# EAGLE design U2FHIDDevice_0 (EAGLE 7.7.0)

## Sheet 1 of 3
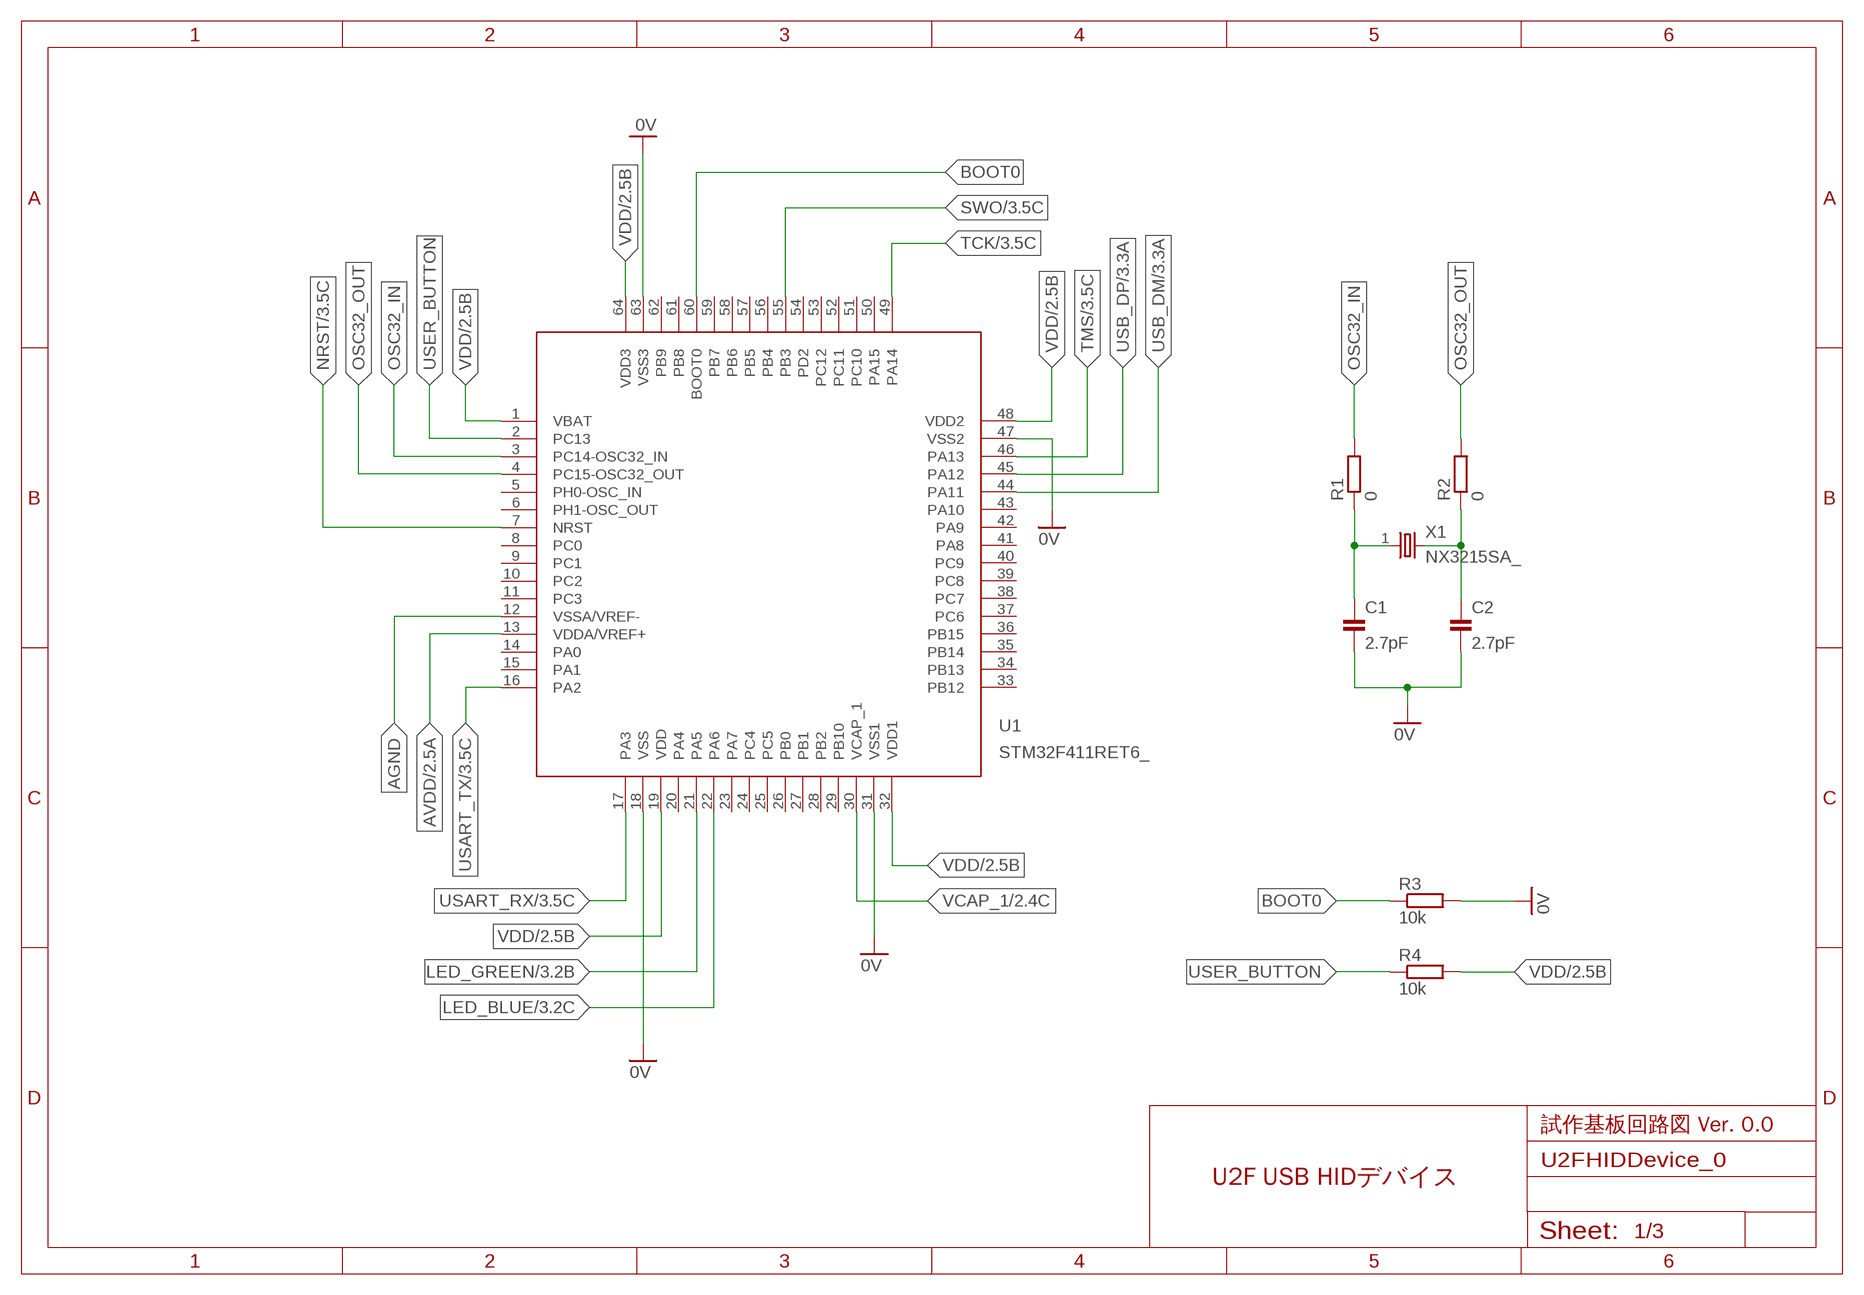
[diagram p0: schematic, sheet 1]

### Parts
C1  2.7pF  CAP_0603  [C0603K]
C2  2.7pF  CAP_0603  [C0603K]
R1  0  RESISTOR_0603  [R0603]
R2  0  RESISTOR_0603  [R0603]
R3  10k  RESISTOR_0603  [R0603]
R4  10k  RESISTOR_0603  [R0603]
U1  STM32F411RET6_  [LQFP64-10X10_DEV]
X1  NX3215SA_  [NX3215_DEV]

### Nets
0V: C1.2 C2.2 R3.2 U1.18(VSS) U1.31(VSS1) U1.47(VSS2) U1.63(VSS3) ; also sheet 2,3
AGND: U1.12(VSSA/VREF-) ; also sheet 2
AVDD: U1.13(VDDA/VREF+) ; also sheet 2
BOOT0: R3.1 U1.60(BOOT0)
LED_BLUE: U1.22(PA6) ; also sheet 3
LED_GREEN: U1.21(PA5) ; also sheet 3
N$2: C1.1 R1.1 X1.1
N$3: C2.1 R2.1 X1.2
NRST: U1.7(NRST) ; also sheet 3
OSC32_IN: R1.2 U1.3(PC14-OSC32_IN)
OSC32_OUT: R2.2 U1.4(PC15-OSC32_OUT)
SWO: U1.55(PB3) ; also sheet 3
TCK: U1.49(PA14) ; also sheet 3
TMS: U1.46(PA13) ; also sheet 3
USART_RX: U1.17(PA3) ; also sheet 3
USART_TX: U1.16(PA2) ; also sheet 3
USB_DM: U1.44(PA11) ; also sheet 3
USB_DP: U1.45(PA12) ; also sheet 3
USER_BUTTON: R4.1 U1.2(PC13)
VCAP_1: U1.30(VCAP_1) ; also sheet 2
VDD: R4.2 U1.1(VBAT) U1.19(VDD) U1.32(VDD1) U1.48(VDD2) U1.64(VDD3) ; also sheet 2
Unconnected: U1.5(PH0-OSC_IN) U1.6(PH1-OSC_OUT) U1.8(PC0) U1.9(PC1) U1.10(PC2) U1.11(PC3) U1.14(PA0) U1.15(PA1) U1.20(PA4) U1.23(PA7) U1.24(PC4) U1.25(PC5) U1.26(PB0) U1.27(PB1) U1.28(PB2) U1.29(PB10) U1.33(PB12) U1.34(PB13) U1.35(PB14) U1.36(PB15) U1.37(PC6) U1.38(PC7) U1.39(PC8) U1.40(PC9) U1.41(PA8) U1.42(PA9) U1.43(PA10) U1.50(PA15) U1.51(PC10) U1.52(PC11) U1.53(PC12) U1.54(PD2) U1.56(PB4) U1.57(PB5) U1.58(PB6) U1.59(PB7) U1.61(PB8) U1.62(PB9)

### Notes on the sheet
- 試作基板回路図 Ver. 0.0
- U2F USB HIDデバイス

## Sheet 2 of 3
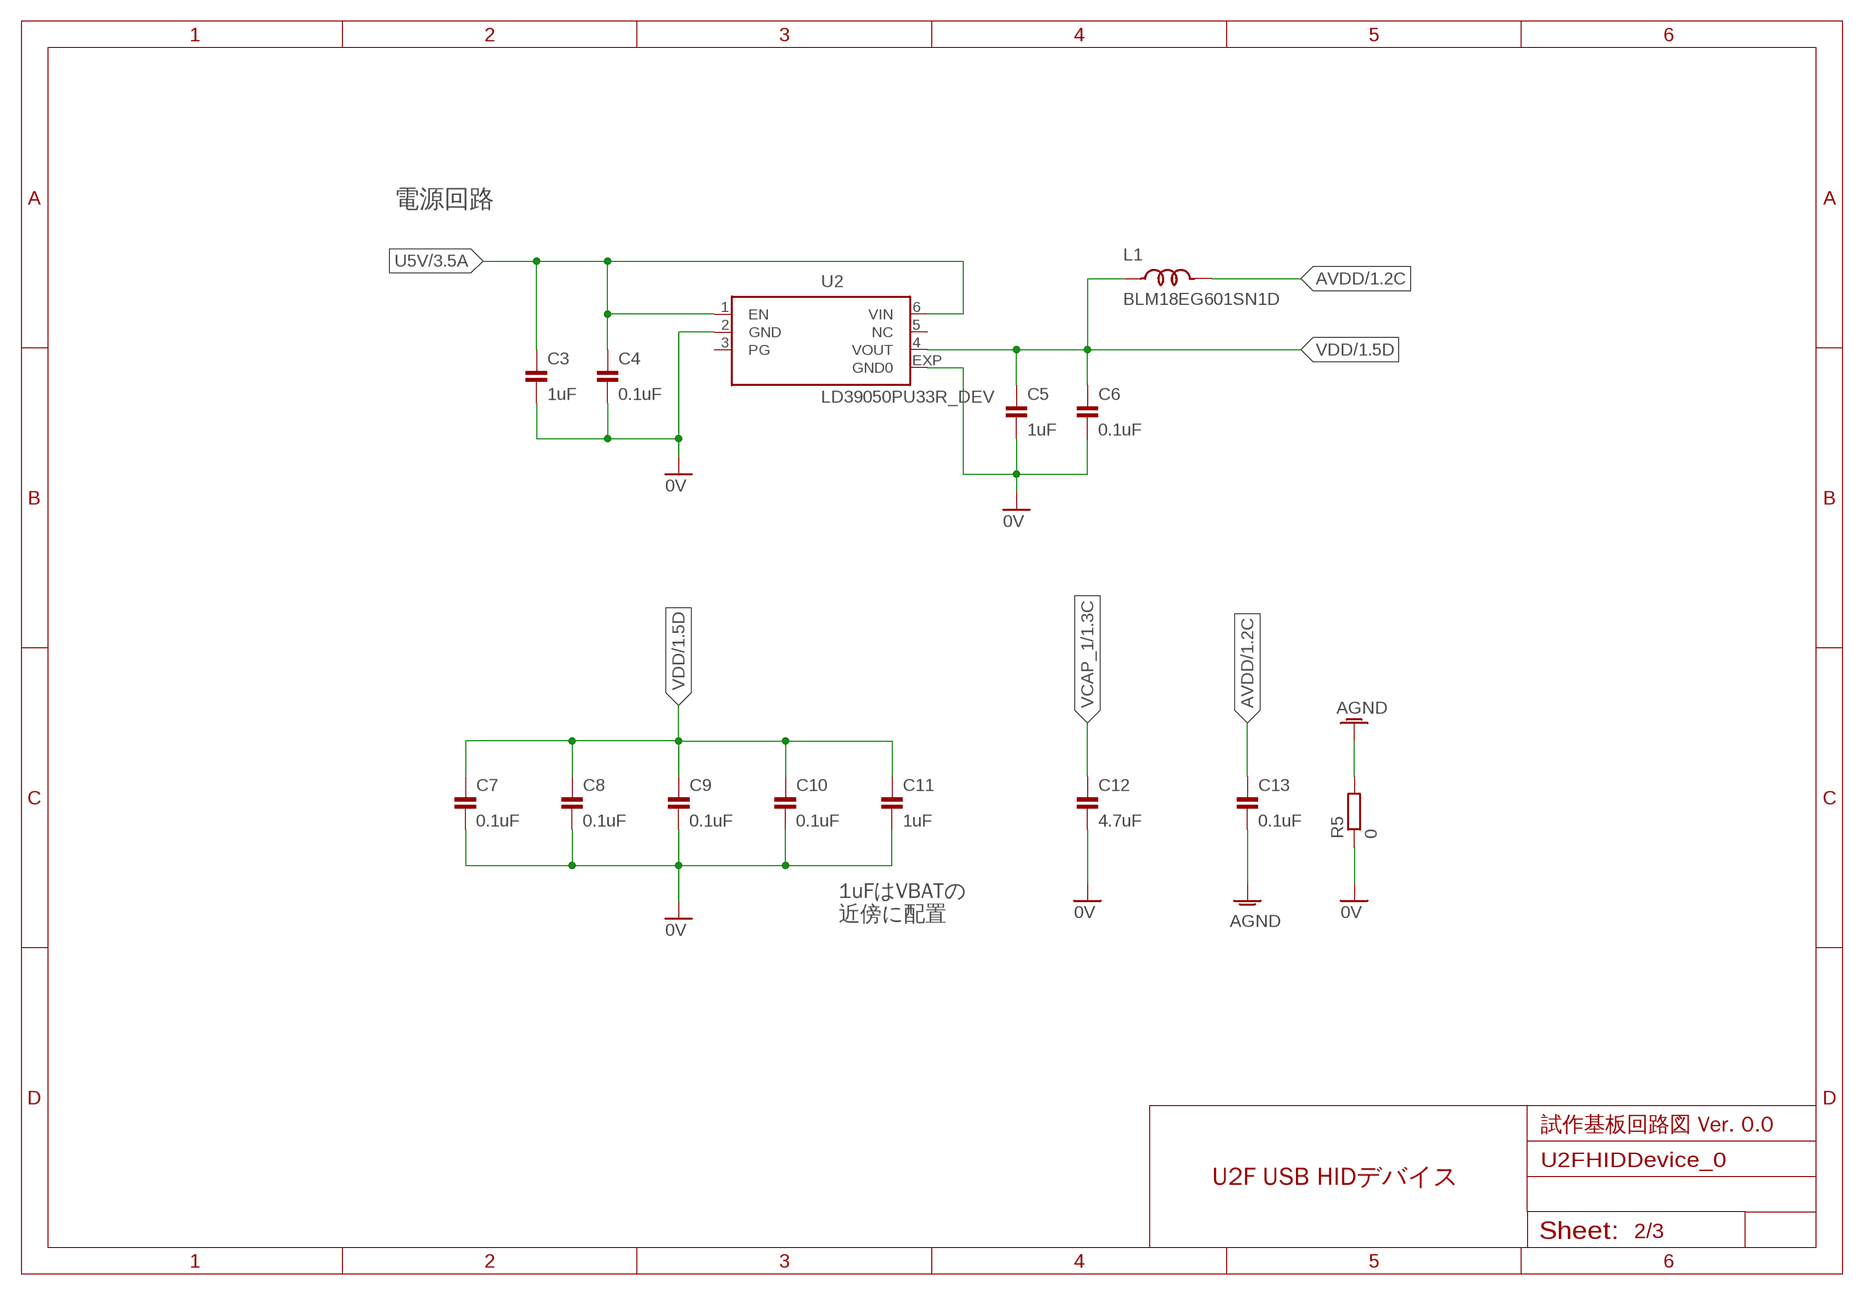
[diagram p1: schematic, sheet 2]

### Parts
C3  1uF  CAP_0603  [C0603K]
C4  0.1uF  CAP_0603  [C0603K]
C5  1uF  CAP_0603  [C0603K]
C6  0.1uF  CAP_0603  [C0603K]
C7  0.1uF  CAP_0603  [C0603K]
C8  0.1uF  CAP_0603  [C0603K]
C9  0.1uF  CAP_0603  [C0603K]
C10  0.1uF  CAP_0603  [C0603K]
C11  1uF  CAP_0603  [C0603K]
C12  4.7uF  CAP_1206  [C1206]
C13  0.1uF  CAP_0603  [C0603K]
L1  BLM18EG601SN1D  [R0603]
R5  0  RESISTOR_0603  [R0603]
U2  LD39050PU33R_DEV  [DFN6-3X3_DEV]

### Nets
0V: C3.2 C4.2 C5.2 C6.2 C7.2 C8.2 C9.2 C10.2 C11.2 C12.2 R5.1 U2.2(GND) U2.EXP(GND0) ; also sheet 1,3
AGND: C13.2 R5.2 ; also sheet 1
AVDD: C13.1 L1.2 ; also sheet 1
U5V: C3.1 C4.1 U2.1(EN) U2.6(VIN) ; also sheet 3
VCAP_1: C12.1 ; also sheet 1
VDD: C5.1 C6.1 C7.1 C8.1 C9.1 C10.1 C11.1 L1.1 U2.4(VOUT) ; also sheet 1
Unconnected: U2.3(PG) U2.5(NC)

### Notes on the sheet
- 電源回路
- 1uFはVBATの
  近傍に配置
- 試作基板回路図 Ver. 0.0
- U2F USB HIDデバイス

## Sheet 3 of 3
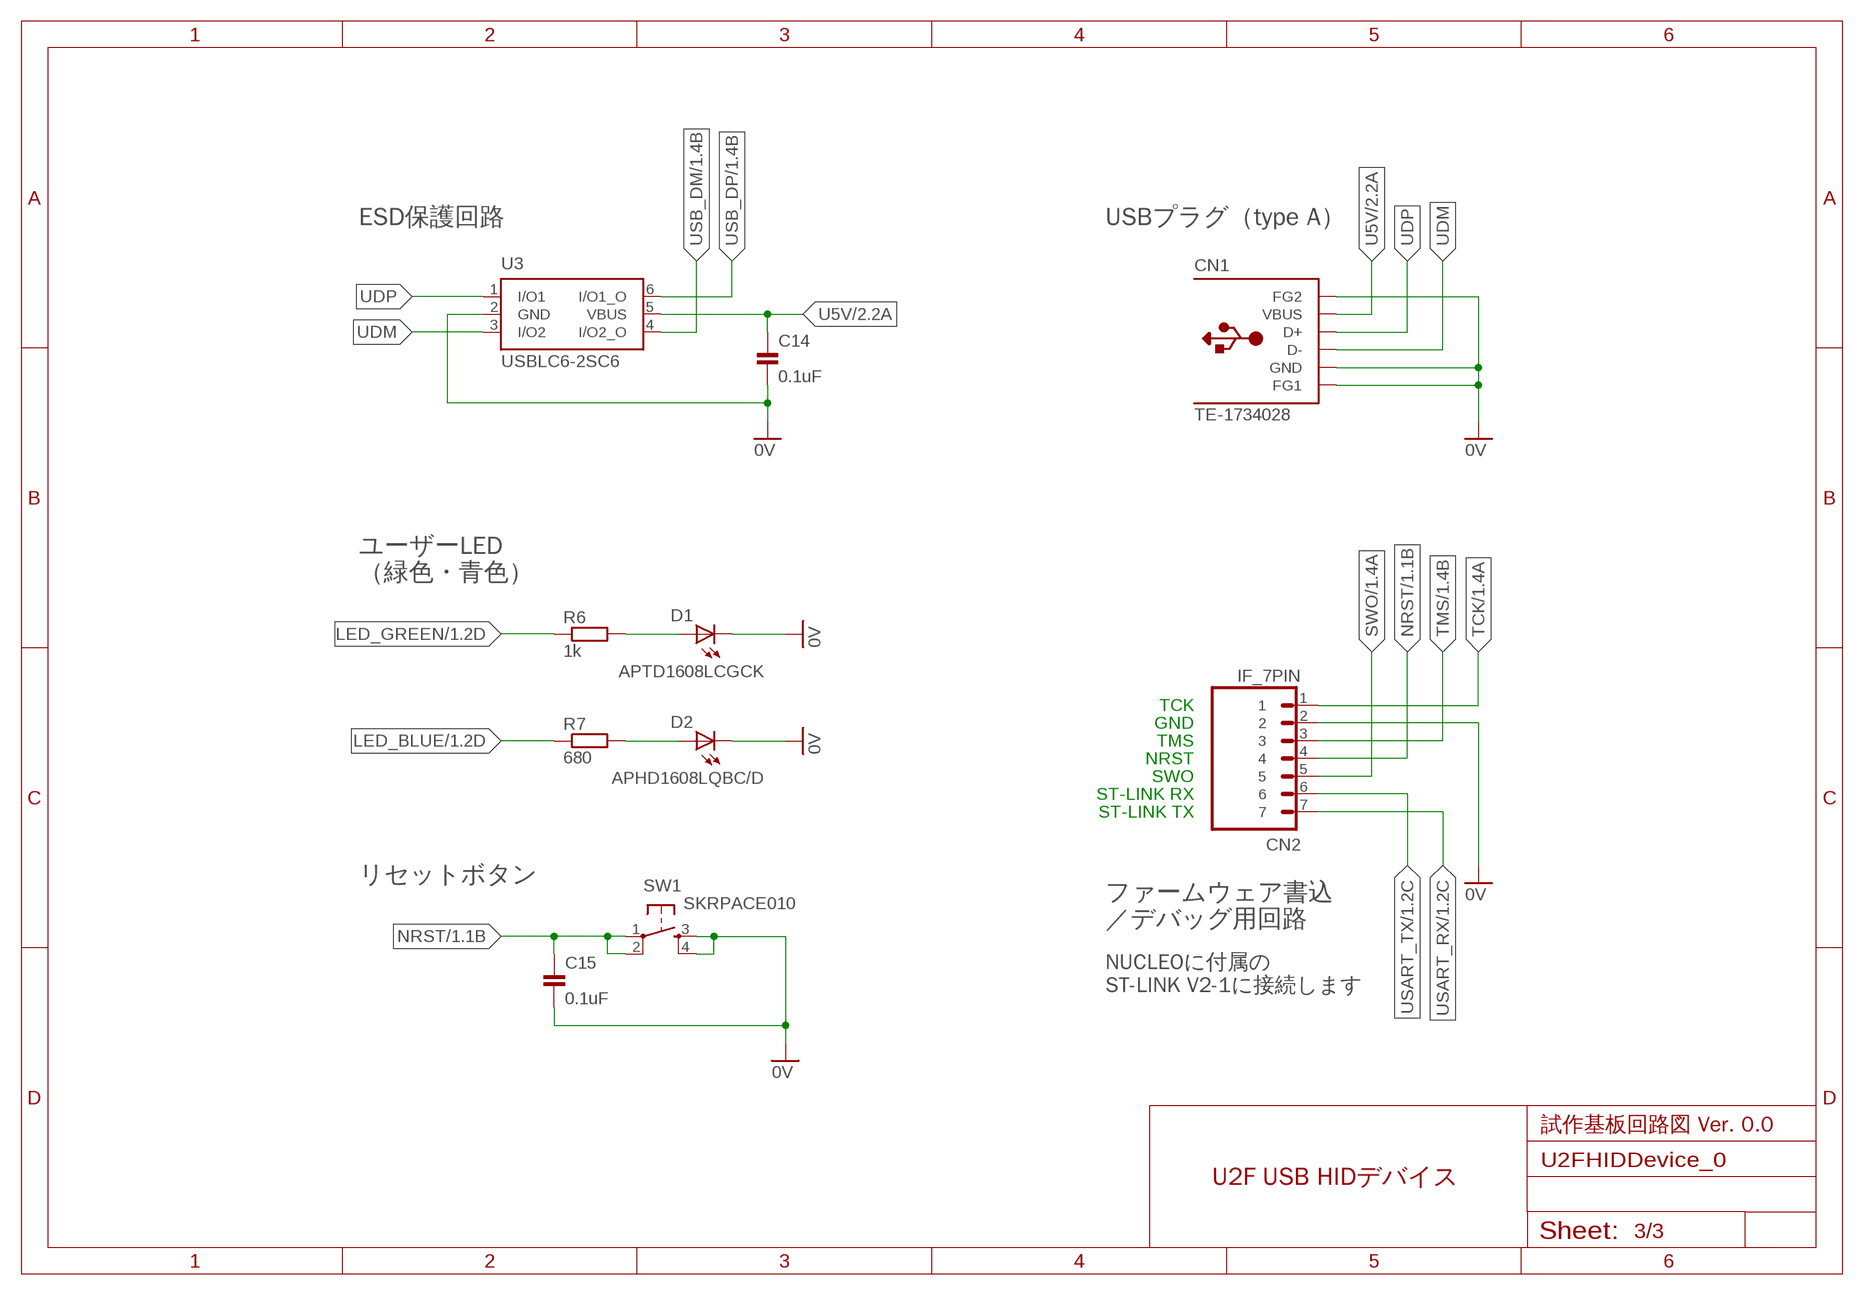
[diagram p2: schematic, sheet 3]

### Parts
C14  0.1uF  CAP_0603  [C0603K]
C15  0.1uF  CAP_0603  [C0603K]
CN1  TE-1734028  [TE-1734028]
CN2  IF_7PIN  [HEADER_7PIN]
D1  APTD1608LCGCK  [CHIPLED_0603]
D2  APHD1608LQBC/D  [CHIPLED_0603]
R6  1k  RESISTOR_0603  [R0603]
R7  680  RESISTOR_0603  [R0603]
SW1  SKRPACE010  [SKRPACE010]
U3  USBLC6-2SC6  [SOT23-6L]

### Nets
0V: C14.2 C15.2 CN1.FG1 CN1.FG2 CN1.P$4(GND) CN2.2 D1.C D2.C SW1.3(S) SW1.4(S1) U3.2(GND) ; also sheet 1,2
LED_BLUE: R7.1 ; also sheet 1
LED_GREEN: R6.1 ; also sheet 1
N$1: D1.A R6.2
N$4: D2.A R7.2
NRST: C15.1 CN2.4 SW1.1(P) SW1.2(P1) ; also sheet 1
SWO: CN2.5 ; also sheet 1
TCK: CN2.1 ; also sheet 1
TMS: CN2.3 ; also sheet 1
U5V: C14.1 CN1.P$1(VBUS) U3.5(VBUS) ; also sheet 2
UDM: CN1.P$2(D-) U3.3(I/O2)
UDP: CN1.P$3(D+) U3.1(I/O1)
USART_RX: CN2.7 ; also sheet 1
USART_TX: CN2.6 ; also sheet 1
USB_DM: U3.4(I/O2_O) ; also sheet 1
USB_DP: U3.6(I/O1_O) ; also sheet 1

### Notes on the sheet
- ESD保護回路 | USBプラグ（type A）
- ユーザーLED
  （緑色・青色）
- TCK
- GND
- TMS
- NRST
- SWO
- ST-LINK RX
- ST-LINK TX
- リセットボタン
- ファームウェア書込
  ／デバッグ用回路
- NUCLEOに付属の
  ST-LINK V2-1に接続します
- 試作基板回路図 Ver. 0.0
- U2F USB HIDデバイス

## Library data of the parts
C1-C15 = Parts:CAP: コンデンサー
CN1 = Connectors:TE-1734028: USB connector plug TE Connectivity
CN2 = Connectors:IF_7PIN: 7-pin インターフェース
D1 = Parts:APTD1608: 発光ダイオード
D2 = Parts:APHD1608: 発光ダイオード
L1 = Parts:BLM18EG: フェライトビーズ インピーダンス: 100 Ohms @ 100 MHz 最大 DC 電流: 2 A 最大 DC 抵抗: 45 mOhms 動作温度範囲: - 55 C to + 125 C
R1-R7 = Parts:RESISTOR: 抵抗器
SW1 = Parts:SKRPACE010: 表面実装用タクトスイッチ ４．２×３．２ｍｍ小型重作動力タイプ ・作動力：２．５５Ｎ ・操作方向：垂直 ・移動量：０．２ｍｍ ・動作寿命：５０，０００ｃｙｃｌｅｓ （５ｍＡ ５ＶＤＣ） ・初期接触抵抗：最大５００ｍΩ
U1 = Parts:STM32F411RE: ARM マイクロコントローラ 最高クロック周波数: 100 MHz プログラム メモリ サイズ: 512 kB データ RAM サイズ: 128 kB ADC分解能: 12 bit I/O 数: 50 I/O 動作供給電圧: 3.3 V 最低動作温度: - 40 C 最高動作温度: + 85 C
U2 = Parts:LD39050PU33R: LDO電圧レギュレータ 出力電圧: 3.3 V 出力電流: 500 mA 入力電圧最大値: 5.5 V 最小入力電圧: + 1.5 V 出力タイプ: Fixed 最低動作温度: - 40 C 最高動作温度: + 125 C
U3 = Parts:USBLC6-2: Very low capacitance ESD protection
X1 = Parts:NX3215SA: 水晶振動子 周波数 32.768kHz 周波数公差 ±20ppm 負荷容量 6pF ESR（等価直列抵抗） 70 kOhms 動作温度 -40°C～85°C

## Board
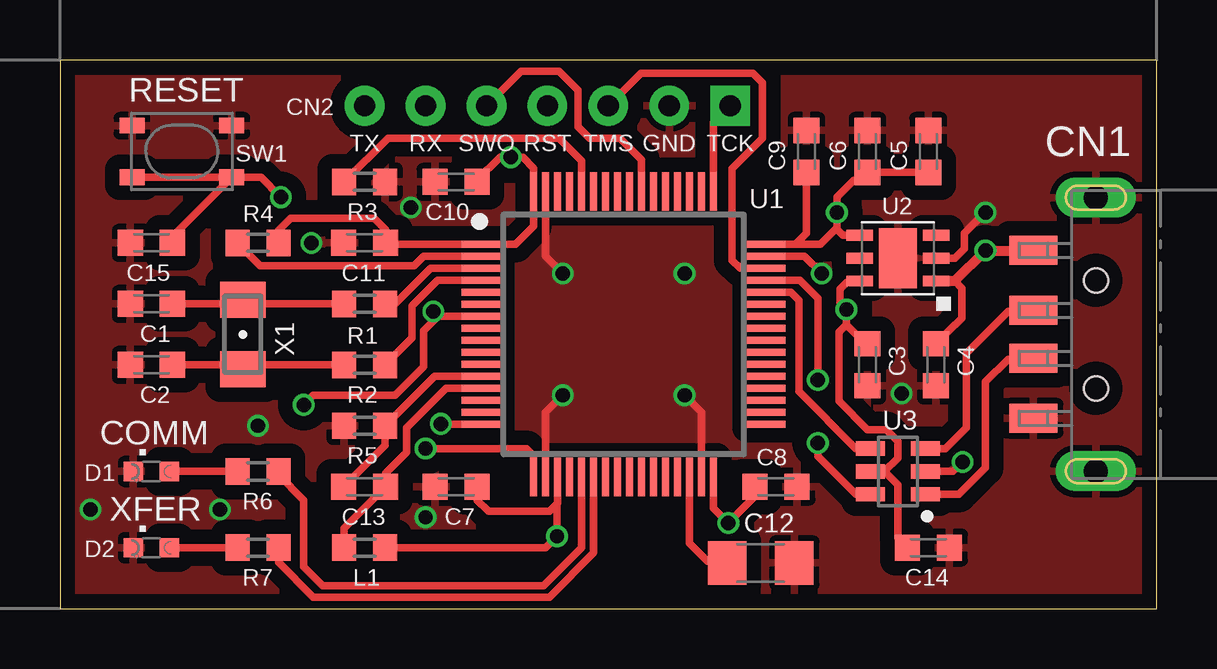
[diagram p3: board, top side]
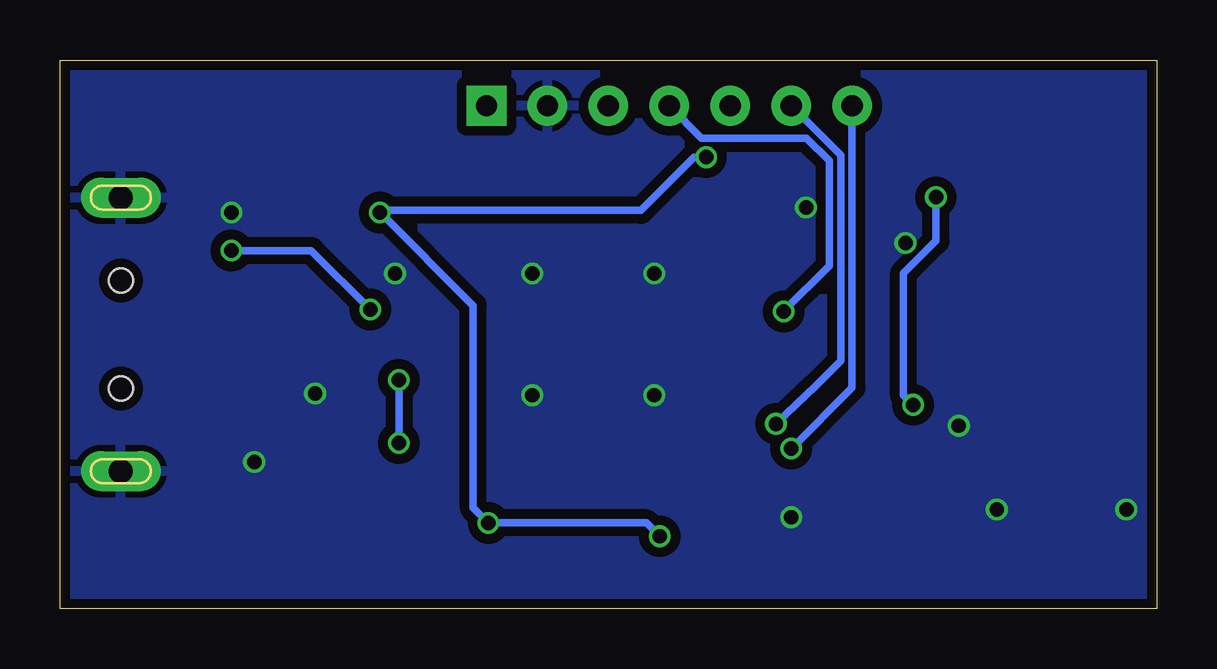
[diagram p4: board, bottom side, seen from below]

Size 45.72 x 22.86 mm. Coordinates in mm from the lower left corner, seen from the top.
Outline: 0,0 45.72,0 45.72,22.86 0,22.86 0,0
Copper layers (1*16): Top 0.035mm / dielectric 1.5mm / Bottom 0.035mm
Design rules "SeeedStudio_2layer_DRU_no_angle_20140221": minimum track width 6mil, minimum drill 12mil, track to track 6mil, track to pad 6mil, pad to pad 6mil, via to via 6mil, smd to smd 0mil, copper to edge 10mil, drill to drill 10mil, minimum pad ring 10mil, minimum via ring 6mil, stop-mask expansion 2mil, vias tented up to drill 100mil, thermal gap 10mil

### Footprints (pad centres in the part's own frame; a part is rotated, then mirrored left to right if it is on the bottom)
C0603K = smd 1.05 x 1.08: 1 -0.875,0; 2 0.875,0
C1206 = smd 1.6 x 1.8: 1 -1.4,0; 2 1.4,0
TE-1734028 = drill 1 pad 1.676 long: FG1 -5.7,0; FG2 5.7,0 | smd 1.2 x 2: P$1 3.5,2.6; P$2 1,2.6; P$3 -1,2.6; P$4 -3.5,2.6 | hole 1: -2.25,0; 2.25,0
HEADER_7PIN = drill 0.889 pad 1.651 square: 1 0,0 | drill 0.889 pad 1.651: 2 2.54,0; 3 5.08,0; 4 7.62,0; 5 10.16,0; 6 12.7,0; 7 15.24,0
CHIPLED_0603 = smd 0.8 x 0.8: A -0.75,0; C 0.75,0
R0603 = smd 1 x 1.1: 1 -0.85,0; 2 0.85,0
SKRPACE010 = smd 1.05 x 0.65: 1 -2.075,1.075; 2 2.075,1.075; 3 -2.075,-1.075; 4 2.075,-1.075
LQFP64-10X10_DEV = smd 1.6 x 0.3: 1 -5.95,3.75; 2 -5.95,3.25; 3 -5.95,2.75; 4 -5.95,2.25; 5 -5.95,1.75; 6 -5.95,1.25; 7 -5.95,0.75; 8 -5.95,0.25; 9 -5.95,-0.25; 10 -5.95,-0.75; 11 -5.95,-1.25; 12 -5.95,-1.75; 13 -5.95,-2.25; 14 -5.95,-2.75; 15 -5.95,-3.25; 16 -5.95,-3.75; 33 5.95,-3.75; 34 5.95,-3.25; 35 5.95,-2.75; 36 5.95,-2.25; 37 5.95,-1.75; 38 5.95,-1.25; 39 5.95,-0.75; 40 5.95,-0.25; 41 5.95,0.25; 42 5.95,0.75; 43 5.95,1.25; 44 5.95,1.75; 45 5.95,2.25; 46 5.95,2.75; 47 5.95,3.25; 48 5.95,3.75 | smd 0.3 x 1.6: 17 -3.75,-5.95; 18 -3.25,-5.95; 19 -2.75,-5.95; 20 -2.25,-5.95; 21 -1.75,-5.95; 22 -1.25,-5.95; 23 -0.75,-5.95; 24 -0.25,-5.95; 25 0.25,-5.95; 26 0.75,-5.95; 27 1.25,-5.95; 28 1.75,-5.95; 29 2.25,-5.95; 30 2.75,-5.95; 31 3.25,-5.95; 32 3.75,-5.95; 49 3.75,5.95; 50 3.25,5.95; 51 2.75,5.95; 52 2.25,5.95; 53 1.75,5.95; 54 1.25,5.95; 55 0.75,5.95; 56 0.25,5.95; 57 -0.25,5.95; 58 -0.75,5.95; 59 -1.25,5.95; 60 -1.75,5.95; 61 -2.25,5.95; 62 -2.75,5.95; 63 -3.25,5.95; 64 -3.75,5.95
DFN6-3X3_DEV = smd 1.1 x 0.45: 1 -1.6,0.95; 2 -1.6,0; 3 -1.6,-0.95; 4 1.6,-0.95; 5 1.6,0; 6 1.6,0.95 | smd 1.6 x 2.5: EXP 0,0
SOT23-6L = smd 0.6 x 1.2: 1 -0.95,-1.15; 2 0,-1.15; 3 0.95,-1.15; 4 0.95,1.15; 5 0,1.15; 6 -0.95,1.15
NX3215_DEV = smd 1.5 x 1.9: 1 -1.45,0; 2 1.45,0

### Placement (x,y rotation side)
C1  3.81,12.7 180 top
C2  3.81,10.16 180 top
C3  33.66,10.16 270 top
C4  36.51,10.16 270 top
C5  36.2,19.05 90 top
C6  33.66,19.05 90 top
C7  16.51,5.08 180 top
C8  29.84,5.08 0 top
C9  31.11,19.05 90 top
C10  16.51,17.78 180 top
C11  12.7,15.24 180 top
C12  29.21,1.91 0 top
C13  12.7,5.08 180 top
C14  36.2,2.54 0 top
C15  3.81,15.24 180 top
CN1  43.18,11.43 90 top
CN2  27.94,20.95 180 top
D1  3.81,5.71 180 top
D2  3.81,2.54 180 top
L1  12.7,2.54 180 top
R1  12.7,12.7 0 top
R2  12.7,10.16 0 top
R3  12.7,17.78 0 top
R4  8.26,15.24 0 top
R5  12.7,7.62 0 top
R6  8.26,5.71 180 top
R7  8.26,2.54 180 top
SW1  5.08,19.05 180 top
U1  23.5,11.43 0 top
U2  34.92,14.61 180 top
U3  34.92,5.71 90 top
X1  7.62,11.43 270 top

### Tracks (layer width: path | path; a pad name or v marks a point on that pad's centre or on a via)
0V  (via drill 0.6)
  Top 0.305: U3.2 37.23,5.71 v37.62,6.11 | U1.18 20.25,8.18 v20.95,8.89 | U1.31 26.75,8.18 v26.04,8.89 | U1.63 20.25,14.68 v20.95,13.97 | U1.47 31.04,14.68 v31.75,13.97 | 38.58,16.35 v38.58,16.51 37.7,15.63 37.7,15 37.3,14.61 U2.2
  other vias: 26.04,13.97 35.08,8.97 8.26,7.62 6.67,4.13 15.24,3.81 14.62,16.71 10.48,15.24 1.27,4.13
  pour Bottom (isolate 0.406, rank 3): -2.54,25.4 48.26,25.4 48.26,-2.54 -2.54,-2.54
  pour Top (isolate 0.61, rank 3): -0.64,23.5 46.35,23.5 46.35,-0.64 -0.64,-0.64
AGND
  Top 0.305: U1.12 15.61,9.68 R5.2 13.55,6.8 C13.2
AVDD
  Top 0.305: U1.13 16.09,9.18 14.45,7.54 14.45,6.51 13.57,5.64 C13.1 11.85,3.35 L1.2
BOOT0
  Top 0.305: U1.60 21.75,18.66 20.8,19.61 13.68,19.61 R3.1
LED_BLUE
  Top 0.305: R7.1 9.11,1.93 10.56,0.48 20.4,0.48 22.25,2.32 U1.22
LED_GREEN
  Top 0.305: R6.1 9.11,5.58 10.16,4.52 10.16,1.75 10.95,0.95 20.16,0.95 21.75,2.54 21.75,5.68 U1.21
N$1
  Top 0.305: D1.A R6.2
N$2
  Top 0.305: C1.1 7.6,12.7 X1.1 7.8,12.7 R1.1
N$3
  Top 0.305: C2.1 7.6,10.16 X1.2 7.8,10.16 R2.1
N$4
  Top 0.305: D2.A R7.2
NRST  (via drill 0.6)
  Top 0.305: SW1.1 SW1.2 | U1.7 15.75,12.18 | 15.75,12.18 15.16,11.59 15.16,10.08 13.97,8.89 10.56,8.89 v10.16,8.49 | C15.1 4.68,15.51 SW1.1 | 15.75,12.18 15.75,12.19 v15.56,12.38 | v9.21,17.14 8.38,17.98 SW1.1
  Bottom 0.305: CN2.4 18.97,19.61 14.61,19.61 13.65,18.65 13.65,14.29 v15.56,12.38 | v10.16,8.49 10.56,8.89 10.56,13.97 9.21,15.32 v9.21,17.14
OSC32_IN
  Top 0.305: R1.2 13.97,12.7 15.45,14.18 U1.3
OSC32_OUT
  Top 0.305: U1.4 15.74,13.68 14.68,12.62 14.68,11.29 R2.2
SWO
  Top 0.305: CN2.5 19.21,22.38 20.8,22.38 21.59,21.59 21.59,20.08 22.07,19.61 23.34,19.61 24.25,18.7 U1.55
TCK
  Top 0.305: U1.49 27.25,20.26 CN2.1
TMS
  Top 0.305: U1.46 28.36,14.18 28.02,14.53 28.02,18.34 29.29,19.61 29.29,21.91 28.89,22.3 24.21,22.3 CN2.3
U5V  (via drill 0.6)
  Top 0.305: C14.1 34.92,2.94 34.92,5.16 34.37,5.71 | C4.1 37.31,11.83 37.33,11.83 37.6,12.1 37.6,13.36 37.31,13.65 | C3.1 33.57,11.04 32.78,11.83 | 32.78,11.83 v32.78,12.46 32.5,12.74 32.5,13.3 32.8,13.6 33.27,13.6 U2.6 | U3.5 34.37,5.71 | 34.37,5.71 34.92,6.27 34.92,6.99 34.45,7.46 33.66,7.46 32.46,8.65 32.46,11.51 32.78,11.83
  Top 0.406: U2.1 36.23,13.65 37.31,13.65 v38.58,14.92 CN1.P$1
  Bottom 0.305: v32.78,12.46 35.24,14.92 v38.58,14.92
UDM
  Top 0.305: U3.3 36.91,6.67 37.78,7.54 37.78,10.64 39.53,12.38 40.53,12.38 CN1.P$2
UDP
  Top 0.305: CN1.P$3 40.55,10.4 39.53,10.4 38.58,9.45 38.58,5.87 37.47,4.76 U3.1
USART_RX  (via drill 0.6)
  Top 0.305: U1.17 19.75,6.37 19.45,6.67 v15.24,6.67
  Bottom 0.305: v15.24,6.67 12.7,9.21 CN2.7
USART_TX  (via drill 0.6)
  Top 0.305: U1.16 15.89,7.68 v15.88,7.7
  Bottom 0.305: v15.88,7.7 14.21,9.29 13.18,10.32 13.18,18.89 CN2.6
USB_DM
  Top 0.305: U3.4 33.18,6.67 30.8,9.05 30.8,12.86 30.48,13.18 U1.44
USB_DP  (via drill 0.6)
  Top 0.305: v31.59,9.53 31.59,12.94 30.85,13.68 U1.45 | v31.59,6.91 31.59,6.35 33.18,4.76 U3.6
  Bottom 0.305: v31.59,9.53 v31.59,6.91
USER_BUTTON
  Top 0.305: U1.2 15.16,14.68 14.76,14.29 8.33,14.29 7.41,15.22 R4.1
VCAP_1
  Top 0.305: U1.30 26.25,2.73 26.99,1.98 27.73,1.98 C12.1
VDD  (via drill 0.6)
  Top 0.305: C10.1 17.39,17.86 18.34,18.81 v18.79,18.81 v18.8,18.8 19.3,18.8 19.75,18.36 U1.64 19.75,15.94 18.99,15.18 U1.1 13.63,15.18 C11.1 13.57,15.8 13.1,16.27 9.6,16.27 9.11,15.77 R4.2 | 33.34,15.55 U2.4 32.65,15.55 32.38,15.81 32.38,15.88 | C5.1 C6.1 33.34,17.86 33.1,17.86 32.38,17.14 v32.38,16.51 32.38,15.88 | U1.32 27.25,4.19 v27.86,3.57 28.97,4.68 C8.1 | C7.1 17.39,4.52 17.86,4.05 20.4,4.05 20.72,4.37 | U1.19 20.75,4.39 20.72,4.37 | 20.72,4.37 v20.72,3.02 20.24,2.54 L1.1 | C9.1 31.11,15.64 30.66,15.18 | U1.48 30.56,15.18 30.66,15.18 | 32.38,15.88 31.69,15.18 30.66,15.18
  Bottom 0.305: v20.72,3.02 21.27,3.57 v27.86,3.57 28.5,4.21 28.5,12.62 v32.38,16.51 32.31,16.59 21.51,16.59 19.3,18.8 v18.8,18.8 v18.79,18.81

### Text on the board
tPlace: RESET | TX | RX | SWO | RST | TMS | GND | TCK | COMM | XFER